# Altium schematic sheet ESP32_Module_V1.0.SchDoc
size A4
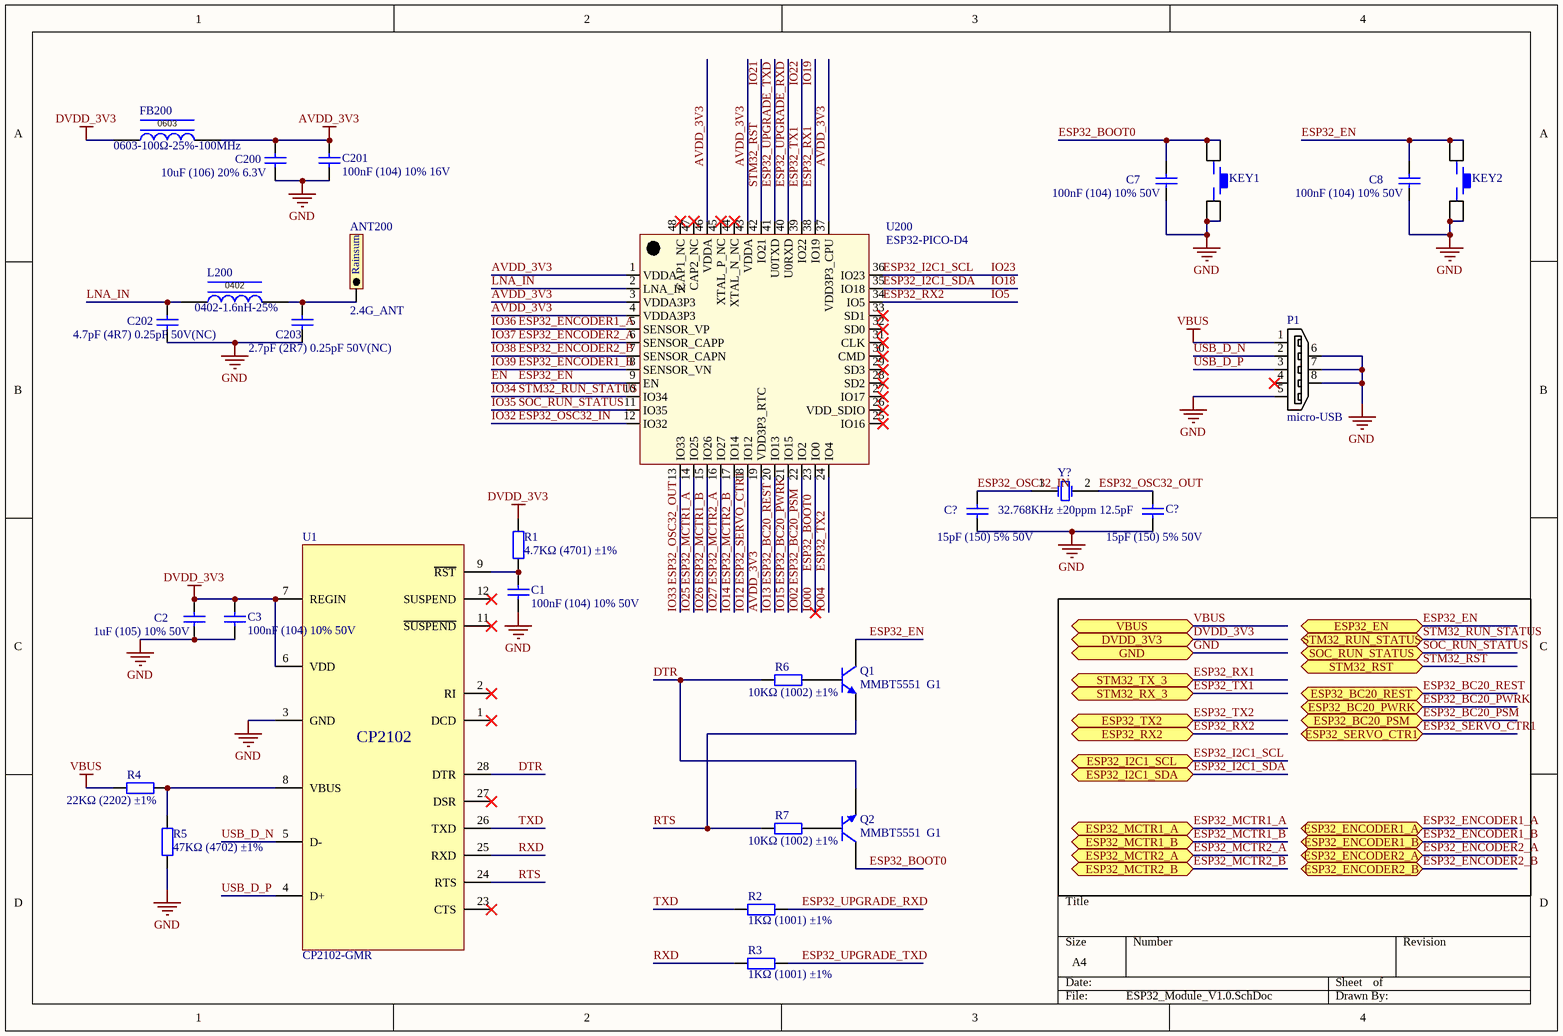
[diagram p0: ESP32_Module_V1.0.SchDoc]

## Parts
(Parts that share a designator on the sheet are numbered #1, #2 ... from top to bottom, then left to right.)
ANT200  2.4G_ANT  [AN9520-245]
C1  100nF (104) 10% 50V  [0603_C]
C2  1uF (105) 10% 50V  [0603_C]
C3  100nF (104) 10% 50V  [0603_C]
C7  100nF (104) 10% 50V  [0603_C]
C8  100nF (104) 10% 50V  [0603_C]
C200  10uF (106) 20% 6.3V  [0402_C]
C201  100nF (104) 10% 16V  [0402_C]
C202  4.7pF (4R7) 0.25pF 50V(NC)  [0402_C]
C203  2.7pF (2R7) 0.25pF 50V(NC)  [0402_C]
C?#1  15pF (150) 5% 50V  [0402_C]
C?#2  15pF (150) 5% 50V  [0402_C]
FB200  0603-100Ω-25%-100MHz  [0603_L]
KEY1  KEY  [KEY_C127478]  (value not drawn)
KEY2  KEY  [KEY_C127478]  (value not drawn)
L200  0402-1.6nH-25%  [0402_L]
P1  micro-USB  [USB_MICRO]
Q1  MMBT5551  G1  [SOT-23(SOT-23-3)]
Q2  MMBT5551  G1  [SOT-23(SOT-23-3)]
R1  4.7KΩ (4701) ±1%  [0603_R]
R2  1KΩ (1001) ±1%  [0603_R]
R3  1KΩ (1001) ±1%  [0603_R]
R4  22KΩ (2202) ±1%  [0603_R]
R5  47KΩ (4702) ±1%  [0603_R]
R6  10KΩ (1002) ±1%  [0603_R]
R7  10KΩ (1002) ±1%  [0603_R]
U1  CP2102-GMR  [QFN-28_5x5x05P]
U200  ESP32-PICO-D4  [QFN-48_7x7x05P]
Y?  32.768KHz ±20ppm 12.5pF  [SMD-3215_2P FC - 135]

## Ports
DVDD_3V3, ESP32_BC20_PSM, ESP32_BC20_PWRK, ESP32_BC20_REST, ESP32_EN, ESP32_ENCODER1_A, ESP32_ENCODER1_B, ESP32_ENCODER2_A, ESP32_ENCODER2_B, ESP32_I2C1_SCL, ESP32_I2C1_SDA, ESP32_MCTR1_A, ESP32_MCTR1_B, ESP32_MCTR2_A, ESP32_MCTR2_B, ESP32_RX2, ESP32_SERVO_CTR1, ESP32_TX2, GND, SOC_RUN_STATUS, STM32_RST, STM32_RUN_STATUS, STM32_RX_3, STM32_TX_3, VBUS

## Nets
AVDD_3V3: C200.2 C201.2 FB200.2 U200.1(VDDA) U200.3(VDDA3P3) U200.4(VDDA3P3) U200.19(VDD3P3_RTC) U200.37(VDD3P3_CPU) U200.43(VDDA) U200.46(VDDA)
DVDD_3V3: C2.2 C3.2 FB200.1 R1.2 U1.6(VDD) U1.7(REGIN) ; port DVDD_3V3
GND: C1.1 C2.1 C3.1 C7.1 C8.1 C200.1 C201.1 C202.1 C203.1 C?#1.1 C?#2.1 KEY1.3 KEY1.4 KEY2.3 KEY2.4 P1.5(GND) P1.6(SHELL) P1.7(SHELL) P1.8(SHELL) R5.1 U1.3(GND) ; port GND
VBUS: P1.1(VBUS) R4.1 ; port VBUS
DTR: Q2.2(E) R6.1 U1.28(DTR)
EN: C8.2 KEY2.1 KEY2.2 Q1.3(C) U200.9(EN) ; port ESP32_EN  [also labelled ESP32_EN]
ESP32_BC20_PSM: U200.22(IO2) ; port ESP32_BC20_PSM  [also labelled IO02]
ESP32_BC20_PWRK: U200.21(IO15) ; port ESP32_BC20_PWRK  [also labelled IO15]
ESP32_BC20_REST: U200.20(IO13) ; port ESP32_BC20_REST  [also labelled IO13]
ESP32_BOOT0: C7.2 KEY1.1 KEY1.2 Q2.3(C) U200.23(IO0)  [also labelled IO00]
ESP32_ENCODER1_A: U200.5(SENSOR_VP) ; port ESP32_ENCODER1_A  [also labelled IO36]
ESP32_ENCODER1_B: U200.8(SENSOR_VN) ; port ESP32_ENCODER1_B  [also labelled IO39]
ESP32_ENCODER2_A: U200.6(SENSOR_CAPP) ; port ESP32_ENCODER2_A  [also labelled IO37]
ESP32_ENCODER2_B: U200.7(SENSOR_CAPN) ; port ESP32_ENCODER2_B  [also labelled IO38]
ESP32_I2C1_SCL: U200.36(IO23) ; port ESP32_I2C1_SCL  [also labelled IO23]
ESP32_I2C1_SDA: U200.35(IO18) ; port ESP32_I2C1_SDA  [also labelled IO18]
ESP32_MCTR1_A: U200.14(IO25) ; port ESP32_MCTR1_A  [also labelled IO25]
ESP32_MCTR1_B: U200.15(IO26) ; port ESP32_MCTR1_B  [also labelled IO26]
ESP32_MCTR2_A: U200.16(IO27) ; port ESP32_MCTR2_A  [also labelled IO27]
ESP32_MCTR2_B: U200.17(IO14) ; port ESP32_MCTR2_B  [also labelled IO14]
ESP32_OSC32_IN: C?#1.2 U200.12(IO32) Y?.1(OSC1)  [also labelled IO32]
ESP32_OSC32_OUT: C?#2.2 U200.13(IO33) Y?.2(OSC2)  [also labelled IO33]
ESP32_RX1: U200.38(IO19) ; port STM32_TX_3  [also labelled IO19]
ESP32_RX2: U200.34(IO5) ; port ESP32_RX2  [also labelled IO5]
ESP32_SERVO_CTR1: U200.18(IO12) ; port ESP32_SERVO_CTR1  [also labelled IO12]
ESP32_TX1: U200.39(IO22) ; port STM32_RX_3  [also labelled IO22]
ESP32_TX2: U200.24(IO4) ; port ESP32_TX2  [also labelled IO04]
ESP32_UPGRADE_RXD: R2.2 U200.40(U0RXD)
ESP32_UPGRADE_TXD: R3.2 U200.41(U0TXD)
IO21: U200.42(IO21) ; port STM32_RST  [also labelled STM32_RST]
IO34: U200.10(IO34) ; port STM32_RUN_STATUS  [also labelled STM32_RUN_STATUS]
IO35: U200.11(IO35) ; port SOC_RUN_STATUS  [also labelled SOC_RUN_STATUS]
LNA_IN: C202.2 L200.1 U200.2(LNA_IN)
RTS: Q1.2(E) R7.1 U1.24(RTS)
RXD: R3.1 U1.25(RXD)
TXD: R2.1 U1.26(TXD)
USB_D_N: P1.2(D-) U1.5(D-)
USB_D_P: P1.3(D+) U1.4(D+)
NetANT200_1: ANT200.1 C203.2 L200.2
NetC1_2: C1.2 R1.1 U1.9(~{RST})
NetQ1_1: Q1.1(B) R6.2
NetQ2_1: Q2.1(B) R7.2
NetR4_2: R4.2 R5.2 U1.8(VBUS)

Not connected (* = marked no-connect by the designer): P1 4(ID)*; U1 1(DCD)* 2(RI)* 11(~{SUSPEND})* 12(SUSPEND)* 23(CTS)* 27(DSR)*; U200 25(IO16)* 26(VDD_SDIO)* 27(IO17)* 28(SD2)* 29(SD3)* 30(CMD)* 31(CLK)* 32(SD0)* 33(SD1)* 44(XTAL_N_NC)* 45(XTAL_P_NC)* 47(CAP2_NC)* 48(CAP1_NC)*

## Notes on the sheet
- (in symbol 2.4G_ANT) Rainsum
- (in symbol 0402 100Ω 25% 100MHz) 0402
- (in symbol 0603 100Ω 25% 100MHz) 0603
- (in symbol CP2102-GMR_[C6568]) CP2102

## Library data of the parts
C1 C3 C7 C8 = 0603 100nF (104) 10% 50V: 贴片电容; ComponentLink1Description: 供应商链接; ComponentLink1URL: http://www.szlcsc.com/product/details_15331.html; Package: 0603; Supplier: LC; SuppliersPartNumber: C14663
C2 = 0603 1uF (105) 10% 50V: 贴片电容; ComponentLink1Description: 供应商链接; ComponentLink1URL: http://www.szlcsc.com/product/details_16531.html; Package: 0603; Supplier: LC; SuppliersPartNumber: C15849
C200 = 0402 10uF (106) 20% 6.3V: 贴片电容; ComponentLink1Description: 供应商链接; ComponentLink1URL: http://www.szlcsc.com/product/details_16204.html; Package: 0402; Supplier: LC; SuppliersPartNumber: C15525
C201 = 0402 100nF (104) 10% 16V: 贴片电容; ComponentLink1Description: 供应商链接; ComponentLink1URL: http://www.szlcsc.com/product/details_1877.html; Package: 0402; Supplier: LC; SuppliersPartNumber: C1525
C202 = 0402 4.7pF (4R7) 0.25pF 50V: 贴片电容; ComponentLink1Description: 供应商链接; ComponentLink1URL: http://www.szlcsc.com/product/details_1921.html; Package: 0402; Supplier: LC; SuppliersPartNumber: C1569
C203 = 0402 2.7pF (2R7) 0.25pF 50V: 贴片电容; ComponentLink1Description: 供应商链接; ComponentLink1URL: http://www.szlcsc.com/product/details_1913.html; Package: 0402; Supplier: LC; SuppliersPartNumber: C1561
C?#1 C?#2 = 0402 15pF (150) 5% 50V: 贴片电容; ComponentLink1Description: 供应商链接; ComponentLink1URL: http://www.szlcsc.com/product/details_1900.html; Package: 0402; Supplier: LC; SuppliersPartNumber: C1548
FB200 = 0603 100Ω 25% 100MHz: 贴片磁珠
L200 = 0402 100Ω 25% 100MHz: 贴片电感
Q1 Q2 = SOT-23 MMBT5551  G1: 三极管; ComponentLink1Description: 供应商链接; ComponentLink1URL: http://www.szlcsc.com/product/details_2502.html; Package: SOT-23; Supplier: LC; SuppliersPartNumber: C2145
R1 = 0603 4.7KΩ (4701) 1%: 贴片电阻; ComponentLink1Description: 供应商链接; ComponentLink1URL: http://www.szlcsc.com/product/details_23889.html; Package: 0603; Supplier: LC; SuppliersPartNumber: C23162
R2 R3 = 0603 1KΩ (1001) 1%: 贴片电阻; ComponentLink1Description: 供应商链接; ComponentLink1URL: http://www.szlcsc.com/product/details_21904.html; Package: 0603; Supplier: LC; SuppliersPartNumber: C21190
R4 = 0603 22KΩ (2202) 1%: 贴片电阻; ComponentLink1Description: 供应商链接; ComponentLink1URL: http://www.szlcsc.com/product/details_32812.html; Package: 0603; Supplier: LC; SuppliersPartNumber: C31850
R5 = 0603 47KΩ (4702) 1%: 贴片电阻; ComponentLink1Description: 供应商链接; ComponentLink1URL: http://www.szlcsc.com/product/details_26562.html; Package: 0603; Supplier: LC; SuppliersPartNumber: C25819
R6 R7 = 0603 10KΩ (1002) 1%: 贴片电阻; ComponentLink1Description: 供应商链接; ComponentLink1URL: http://www.szlcsc.com/product/details_26547.html; Package: 0603; Supplier: LC; SuppliersPartNumber: C25804
U1 = CP2102-GMR_[C6568]: USB; ComponentLink1Description: 供应商链接; ComponentLink1URL: http://www.szlcsc.com/product/details_7033.html; Package: QFN-28_5x5x05P; Supplier: LC; SuppliersPartNumber: C6568
U200 = ESP32-PICO-D4: WIFI_BLE IC
Y? = SMD-3215_2P 32.768KHz 20ppm 12.5pF: 贴片晶振; ComponentLink1Description: 供应商链接; ComponentLink1URL: http://www.szlcsc.com/product/details_33310.html; Package: SMD-3215_2P; Supplier: LC; SuppliersPartNumber: C32346